# EAGLE schematic schematic_breakout_pcb (EAGLE 9.7.0)
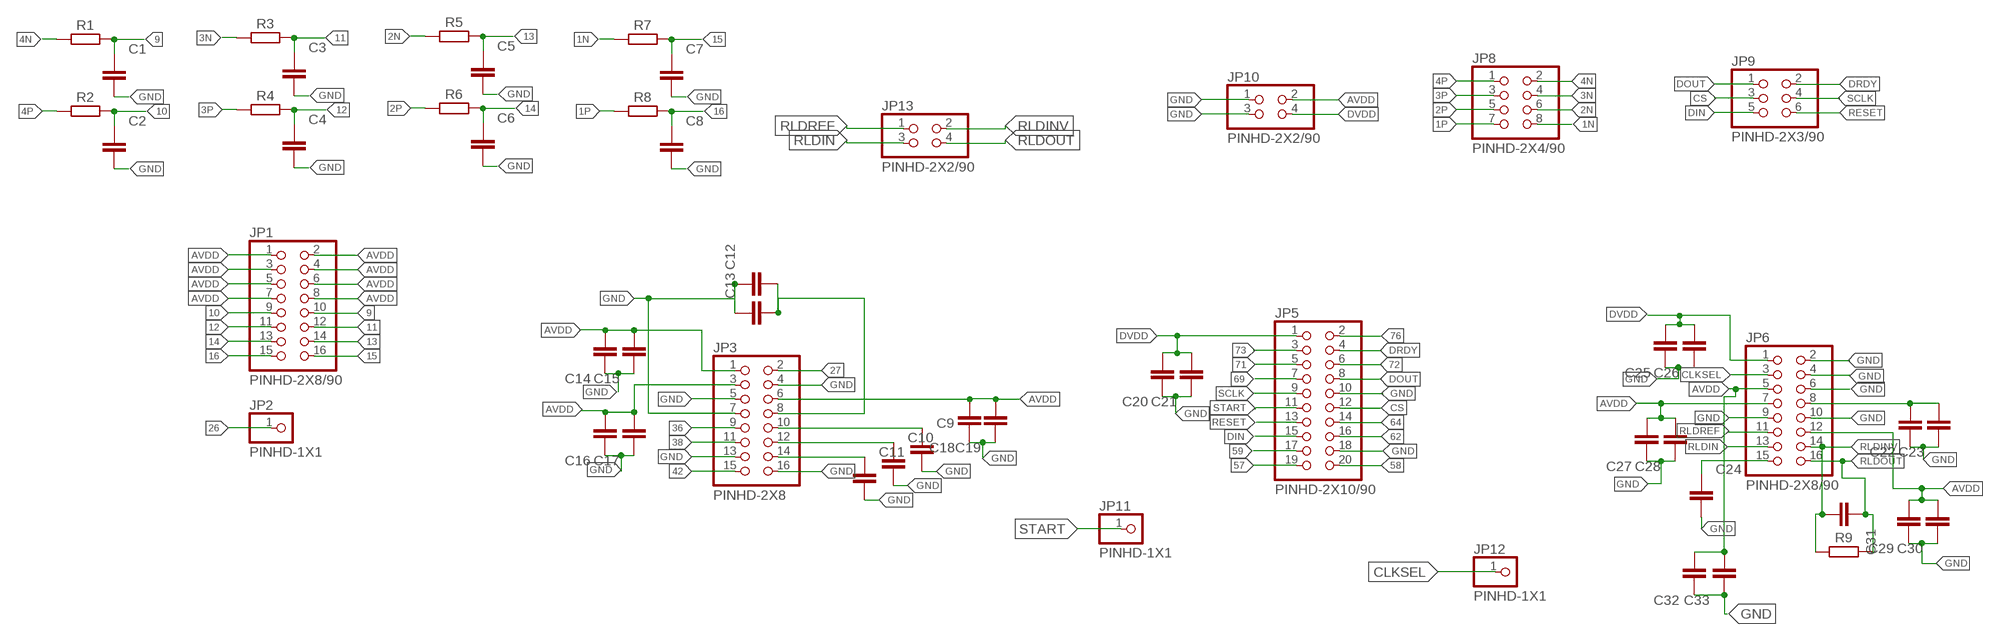
[diagram p0: schematic, sheet 1]

## Parts
C1  C_TANTALUM-1206(3216-METRIC)  [CAPM3216X180]
C2  C_TANTALUM-1206(3216-METRIC)  [CAPM3216X180]
C3  C_TANTALUM-1206(3216-METRIC)  [CAPM3216X180]
C4  C_TANTALUM-1206(3216-METRIC)  [CAPM3216X180]
C5  C_TANTALUM-1206(3216-METRIC)  [CAPM3216X180]
C6  C_TANTALUM-1206(3216-METRIC)  [CAPM3216X180]
C7  C_TANTALUM-1206(3216-METRIC)  [CAPM3216X180]
C8  C_TANTALUM-1206(3216-METRIC)  [CAPM3216X180]
C9  C_TANTALUM-1206(3216-METRIC)  [CAPM3216X180]
C10  C_TANTALUM-1206(3216-METRIC)  [CAPM3216X180]
C11  C_TANTALUM-1206(3216-METRIC)  [CAPM3216X180]
C12  C_TANTALUM-1206(3216-METRIC)  [CAPM3216X180]
C13  C_TANTALUM-1206(3216-METRIC)  [CAPM3216X180]
C14  C_TANTALUM-1206(3216-METRIC)  [CAPM3216X180]
C15  C_TANTALUM-1206(3216-METRIC)  [CAPM3216X180]
C16  C_TANTALUM-1206(3216-METRIC)  [CAPM3216X180]
C17  C_TANTALUM-1206(3216-METRIC)  [CAPM3216X180]
C18  C_TANTALUM-1206(3216-METRIC)  [CAPM3216X180]
C19  C_TANTALUM-1206(3216-METRIC)  [CAPM3216X180]
C20  C_TANTALUM-1206(3216-METRIC)  [CAPM3216X180]
C21  C_TANTALUM-1206(3216-METRIC)  [CAPM3216X180]
C22  C_TANTALUM-1206(3216-METRIC)  [CAPM3216X180]
C23  C_TANTALUM-1206(3216-METRIC)  [CAPM3216X180]
C24  C_TANTALUM-1206(3216-METRIC)  [CAPM3216X180]
C25  C_TANTALUM-1206(3216-METRIC)  [CAPM3216X180]
C26  C_TANTALUM-1206(3216-METRIC)  [CAPM3216X180]
C27  C_TANTALUM-1206(3216-METRIC)  [CAPM3216X180]
C28  C_TANTALUM-1206(3216-METRIC)  [CAPM3216X180]
C29  C_TANTALUM-1206(3216-METRIC)  [CAPM3216X180]
C30  C_TANTALUM-1206(3216-METRIC)  [CAPM3216X180]
C31  C_TANTALUM-1206(3216-METRIC)  [CAPM3216X180]
C32  C_TANTALUM-1206(3216-METRIC)  [CAPM3216X180]
C33  C_TANTALUM-1206(3216-METRIC)  [CAPM3216X180]
JP1  PINHD-2X8/90  [2X08/90]
JP2  PINHD-1X1  [1X01]
JP3  PINHD-2X8  [2X08]
JP5  PINHD-2X10/90  [2X10/90]
JP6  PINHD-2X8/90  [2X08/90]
JP8  PINHD-2X4/90  [2X04/90]
JP9  PINHD-2X3/90  [2X03/90]
JP10  PINHD-2X2/90  [2X02/90]
JP11  PINHD-1X1  [1X01]
JP12  PINHD-1X1  [1X01]
JP13  PINHD-2X2/90  [2X02/90]
R1  R_CHIP-1206(3216-METRIC)  [RESC3216X70]
R2  R_CHIP-1206(3216-METRIC)  [RESC3216X70]
R3  R_CHIP-1206(3216-METRIC)  [RESC3216X70]
R4  R_CHIP-1206(3216-METRIC)  [RESC3216X70]
R5  R_CHIP-1206(3216-METRIC)  [RESC3216X70]
R6  R_CHIP-1206(3216-METRIC)  [RESC3216X70]
R7  R_CHIP-1206(3216-METRIC)  [RESC3216X70]
R8  R_CHIP-1206(3216-METRIC)  [RESC3216X70]
R9  R_CHIP-1206(3216-METRIC)  [RESC3216X70]

## Nets
1N: JP8.8 R7.1
1P: JP8.7 R8.1
2N: JP8.6 R5.1
2P: JP8.5 R6.1
3N: JP8.4 R3.1
3P: JP8.3 R4.1
4N: JP8.2 R1.1
4P: JP8.1 R2.1
9: C1.1 JP1.10 R1.2
10: C2.1 JP1.9 R2.2
11: C3.1 JP1.12 R3.2
12: C4.1 JP1.11 R4.2
13: C5.1 JP1.14 R5.2
14: C6.1 JP1.13 R6.2
15: C7.1 JP1.16 R7.2
16: C8.1 JP1.15 R8.2
26: JP2.1
27: JP3.2
36: JP3.9
38: JP3.11
42: JP3.15
57: JP5.19
58: JP5.20
59: JP5.17
62: JP5.16
64: JP5.14
69: JP5.7
71: JP5.5
72: JP5.6
73: JP5.3
76: JP5.2
AVDD: C14.2 C15.2 C16.2 C17.2 C18.2 C19.2 C27.2 C28.2 C29.2 C30.2 C32.2 C33.2 JP1.1 JP1.2 JP1.3 JP1.4 JP1.5 JP1.6 JP1.7 JP1.8 JP3.1 JP3.3 JP3.6 JP6.5 JP6.7 JP6.12 JP10.2
CLKSEL: JP6.3 JP12.1
CS: JP5.12 JP9.3
DIN: JP5.15 JP9.5
DOUT: JP5.8 JP9.1
DRDY: JP5.4 JP9.2
DVDD: C20.2 C21.2 C25.2 C26.2 JP5.1 JP6.1 JP10.4
GND: C1.2 C2.2 C3.2 C4.2 C5.2 C6.2 C7.2 C8.2 C9.2 C10.2 C11.2 C12.1 C13.1 C14.1 C15.1 C16.1 C17.1 C18.1 C19.1 C20.1 C21.1 C22.1 C23.1 C24.2 C25.1 C26.1 C27.1 C28.1 C29.1 C30.1 C32.1 C33.1 JP3.4 JP3.5 JP3.7 JP3.13 JP3.16 JP5.10 JP5.18 JP6.2 JP6.4 JP6.6 JP6.9 JP6.10 JP10.1 JP10.3
N$1: C9.1 JP3.10
N$2: C10.1 JP3.12
N$3: C11.1 JP3.14
N$4: C12.2 C13.2 JP3.8
N$6: C22.2 C23.2 JP6.8
N$7: C24.1 JP6.15
RESET: JP5.13 JP9.6
RLDIN: JP6.13 JP13.3
RLDINV: C31.2 JP6.14 JP13.2 R9.1
RLDOUT: C31.1 JP6.16 JP13.4 R9.2
RLDREF: JP6.11 JP13.1
SCLK: JP5.9 JP9.4
START: JP5.11 JP11.1

## Library data of the parts
C1-C33 = Capacitor:C: Capacitor - Generic; CATEGORY: Capacitor
JP1 JP3 JP6 = Connector:PINHD-2X8: PIN HEADER; CATEGORY: CONNECTOR; SUB-CATEGORY: PIN-HEADER
JP2 JP11 JP12 = Connector:PINHD-1X1: PIN HEADER; CATEGORY: CONNECTOR; SUB-CATEGORY: PIN-HEADER
JP5 = Connector:PINHD-2X10: PIN HEADER; CATEGORY: CONNECTOR; SUB-CATEGORY: PIN-HEADER
JP8 = Connector:PINHD-2X4: PIN HEADER; CATEGORY: CONNECTOR; SUB-CATEGORY: PIN-HEADER
JP9 = Connector:PINHD-2X3: PIN HEADER; CATEGORY: CONNECTOR; SUB-CATEGORY: PIN-HEADER
JP10 JP13 = Connector:PINHD-2X2: PIN HEADER; CATEGORY: CONNECTOR; SUB-CATEGORY: PIN-HEADER
R1-R9 = Resistor:R: Resistor Fixed - Generic; CATEGORY: Resistor; SUB-CATEGORY: Fixed